# EAGLE design ArdulonShiled for Arduino_DUE (EAGLE 6.2)
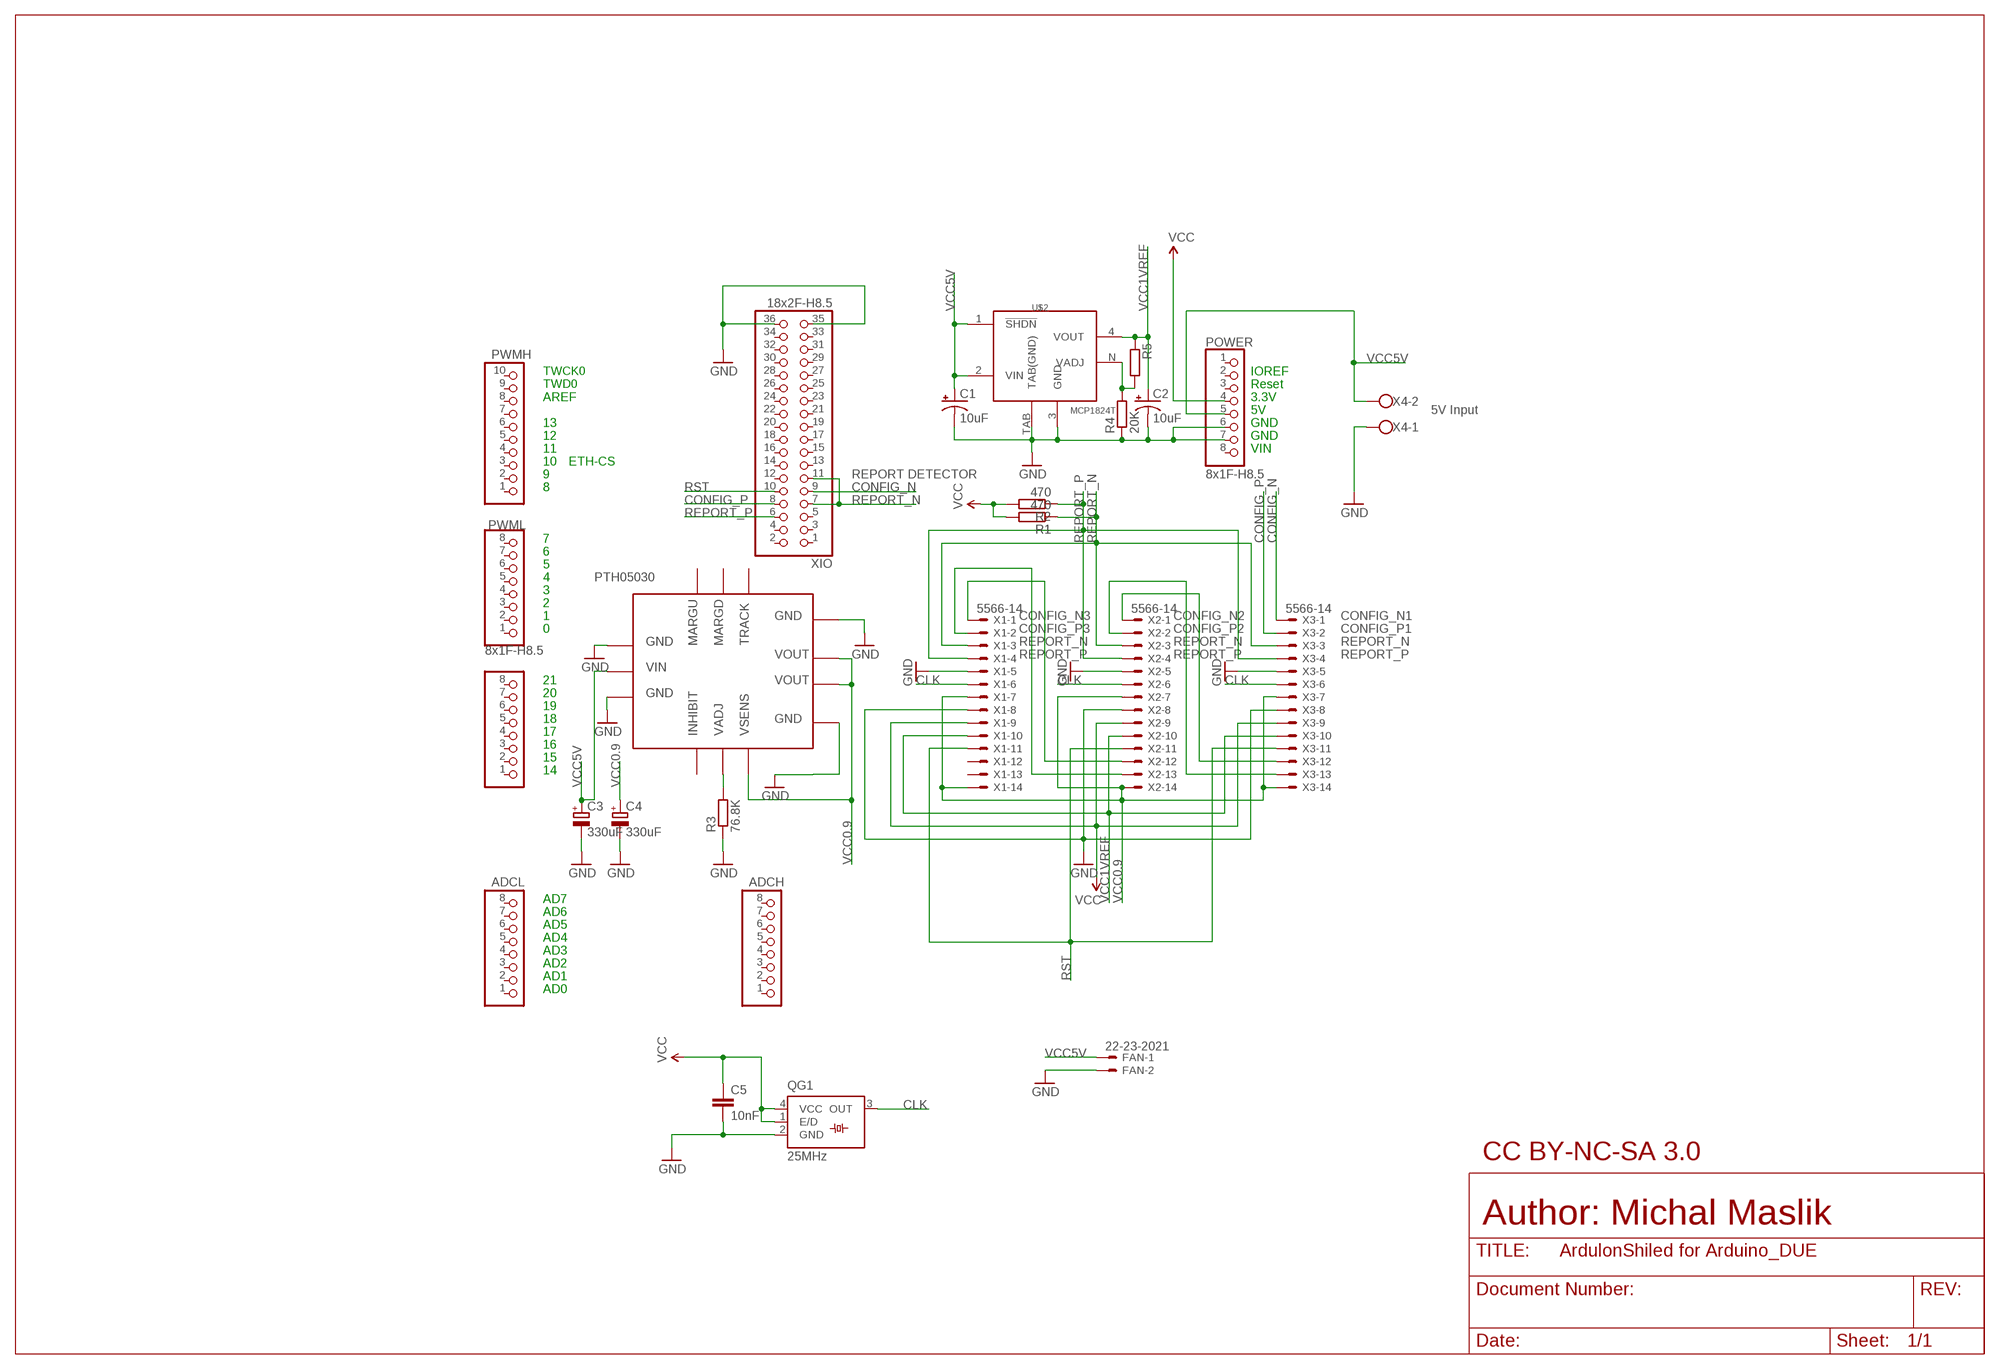
[diagram p0: schematic, sheet 1]

## Parts
ADCH  8x1F-H8.5  PINHD-1X8  [1X08]
ADCL  8x1F-H8.5  PINHD-1X8  [1X08]
C1  10uF  CAP_POL3528-KIT  [EIA3528-KIT]
C2  10uF  CAP_POL3528-KIT  [EIA3528-KIT]
C3  330uF  CPOL-EUSMCE  [SMC_E]
C4  330uF  CPOL-EUSMCE  [SMC_E]
C5  10nF  C-EUC0805  [C0805]
COMMUNICATION  8x1F-H8.5  PINHD-1X8  [1X08]
FAN  22-23-2021  [22-23-2021]
POWER  8x1F-H8.5  PINHD-1X8  [1X08]
PWMH  10x1F-H8.5  PINHD-1X10  [1X10]
PWML  8x1F-H8.5  PINHD-1X8  [1X08]
QG1  25MHz  SM77H  [SM77H]
R1  470  R-EU_M0805  [M0805]
R2  470  R-EU_M0805  [M0805]
R3  76.8K  R-EU_M0805  [M0805]
R4  20K  R-EU_M0805  [M0805]
R5  R-EU_M0805  [M0805]
U$1  PTH05030  [PTH05030]
U$2  MCP1824T  [SOT223-5]
X1  5566-14  [5566-14]
X2  5566-14  [5566-14]
X3  5566-14  [5566-14]
X4  W237-102  [W237-102]
XIO  18x2F-H8.5  PINHD-2X18  [2X18]

## Nets
CLK: QG1.3(OUT) X1.6 X2.6 X3.6
CONFIG_N: X3.1 XIO.9
CONFIG_P: X3.2 XIO.8
GND: C1.C(-) C2.C(-) C3.- C4.- C5.2 FAN.2 POWER.6 POWER.7 QG1.2(GND) R3.1 R4.1 U$1.1 U$1.3 U$1.7 U$1.10 U$2.3(GND) U$2.TAB(TAB(GND)) X1.5 X1.8 X2.5 X2.8 X3.5 X3.8 X4.1 XIO.35 XIO.36
N$1: R4.2 R5.2 U$2.N(VADJ)
N$2: X2.1 X3.12
N$3: R3.2 U$1.5
N$4: X2.2 X3.13
N$5: X1.1 X2.12
N$6: X1.2 X2.13
REPORT_N: R1.1 X1.3 X2.3 X3.3 XIO.7 XIO.11
REPORT_P: R2.1 X1.4 X2.4 X3.4 XIO.6
RST: X1.11 X2.11 X3.11 XIO.10
VCC: C5.1 POWER.4 QG1.1(E/D) QG1.4(VCC) R1.2 R2.2 X1.9 X2.9 X3.9
VCC0.9: C4.+ U$1.6 U$1.8 U$1.9 X1.7 X1.14 X2.7 X2.14 X3.7 X3.14
VCC1REF: C2.A(+) R5.1 U$2.4(VOUT) X1.10 X2.10 X3.10
VCC5V: C1.A(+) C3.+ FAN.1 POWER.5 U$1.2 U$2.1(!SHDN) U$2.2(VIN) X4.2
Unconnected: ADCH.1 ADCH.2 ADCH.3 ADCH.4 ADCH.5 ADCH.6 ADCH.7 ADCH.8 ADCL.1 ADCL.2 ADCL.3 ADCL.4 ADCL.5 ADCL.6 ADCL.7 ADCL.8 COMMUNICATION.1 COMMUNICATION.2 COMMUNICATION.3 COMMUNICATION.4 COMMUNICATION.5 COMMUNICATION.6 COMMUNICATION.7 COMMUNICATION.8 POWER.1 POWER.2 POWER.3 POWER.8 PWMH.1 PWMH.2 PWMH.3 PWMH.4 PWMH.5 PWMH.6 PWMH.7 PWMH.8 PWMH.9 PWMH.10 PWML.1 PWML.2 PWML.3 PWML.4 PWML.5 PWML.6 PWML.7 PWML.8 U$1.4 U$1.11 U$1.12 U$1.13 X1.12 X1.13 XIO.1 XIO.2 XIO.3 XIO.4 XIO.5 XIO.12 XIO.13 XIO.14 XIO.15 XIO.16 XIO.17 XIO.18 XIO.19 XIO.20 XIO.21 XIO.22 XIO.23 XIO.24 XIO.25 XIO.26 XIO.27 XIO.28 XIO.29 XIO.30 XIO.31 XIO.32 XIO.33 XIO.34

## Notes on the sheet
- VCC5V | VCC1VREF
- VCC5V
- TWCK0 | IOREF
- TWD0 | Reset
- AREF | 3.3V
- 5V | 5V Input
- 13 | GND
- 12 | GND
- 11 | VIN
- 10 | ETH-CS
- 9 | REPORT DETECTOR
- 8 | RST | CONFIG_N
- CONFIG_P | REPORT_N
- REPORT_P
- 7 | REPORT_P | REPORT_N | CONFIG_P | CONFIG_N
- 6
- 5
- 4
- 3
- 2
- 1 | CONFIG_N3 | CONFIG_N2 | CONFIG_N1
- 0 | CONFIG_P3 | CONFIG_P2 | CONFIG_P1
- REPORT_N | REPORT_N | REPORT_N
- REPORT_P | REPORT_P | REPORT_P
- 21 | CLK | CLK | CLK
- 20
- 19
- 18
- 17
- 16
- 15
- 14
- VCC5V | VCC0.9
- VCC0.9
- AD7 | VCC1VREF | VCC0.9
- AD6
- AD5
- AD4
- AD3
- AD2
- AD1 | RST
- AD0
- VCC5V
- CLK
- CC BY-NC-SA 3.0
- Author: Michal Maslik

## Library data of the parts
ADCH ADCL COMMUNICATION POWER PWML = SmartPrj:PINHD-1X8: PIN HEADER
C1 C2 = SparkFun:CAP_POL: Capacitor Polarized These are standard SMD and PTH capacitors. Normally 10uF, 47uF, and 100uF in electrolytic and tantalum varieties. Always verify the external diameter of the through hole cap, it varies with capacity, voltage, and manufacturer. The EIA devices should be standard.
C3 C4 = resistor:CPOL-EU: POLARIZED CAPACITOR, European symbol
C5 = rcl:C-EU: CAPACITOR, European symbol
FAN = con-molex:22-23-2021: .100" (2.54mm) Center Header - 2 Pin
PWMH = SmartPrj:PINHD-1X10: PIN HEADER
QG1 = crystal:SM77H: 3.3V CMOS Clock Oscillator Source: www.pletronics.com .. sm77h%203.3v.pdf; OC_FARNELL: unknown; OC_NEWARK: unknown
R1-R5 = rcl:R-EU_: RESISTOR, European symbol
U$1 = PTH5030WAS:PTH05030: PTH05030W DC/DC Converter - Adjustable, 108W
U$2 = BaseApp:MCP1824T
X1-X3 = con-molex:5566-14: Mini FIT connector 14 pol Source: http://www.molex.com
X4 = con-wago-500:W237-102: WAGO SCREW CLAMP; MPN: 237-102; OC_FARNELL: unknown; OC_NEWARK: 70K9898
XIO = SmartPrj:PINHD-2X18: PIN HEADER

## Net classes
0 default: width 0.203 mm, drill 0.305 mm, clearance 0.203 mm
1 USB: drill 0.406 mm, clearance 0.203 mm to class 0, clearance 0.406 mm
2 gnd: width 0.305 mm, drill 0.406 mm, clearance 0.203 mm to class 0, clearance 0.203 mm
3 usbvcc: width 0.61 mm, drill 0.508 mm, clearance 0.203 mm to class 0, clearance 0.254 mm

## Board
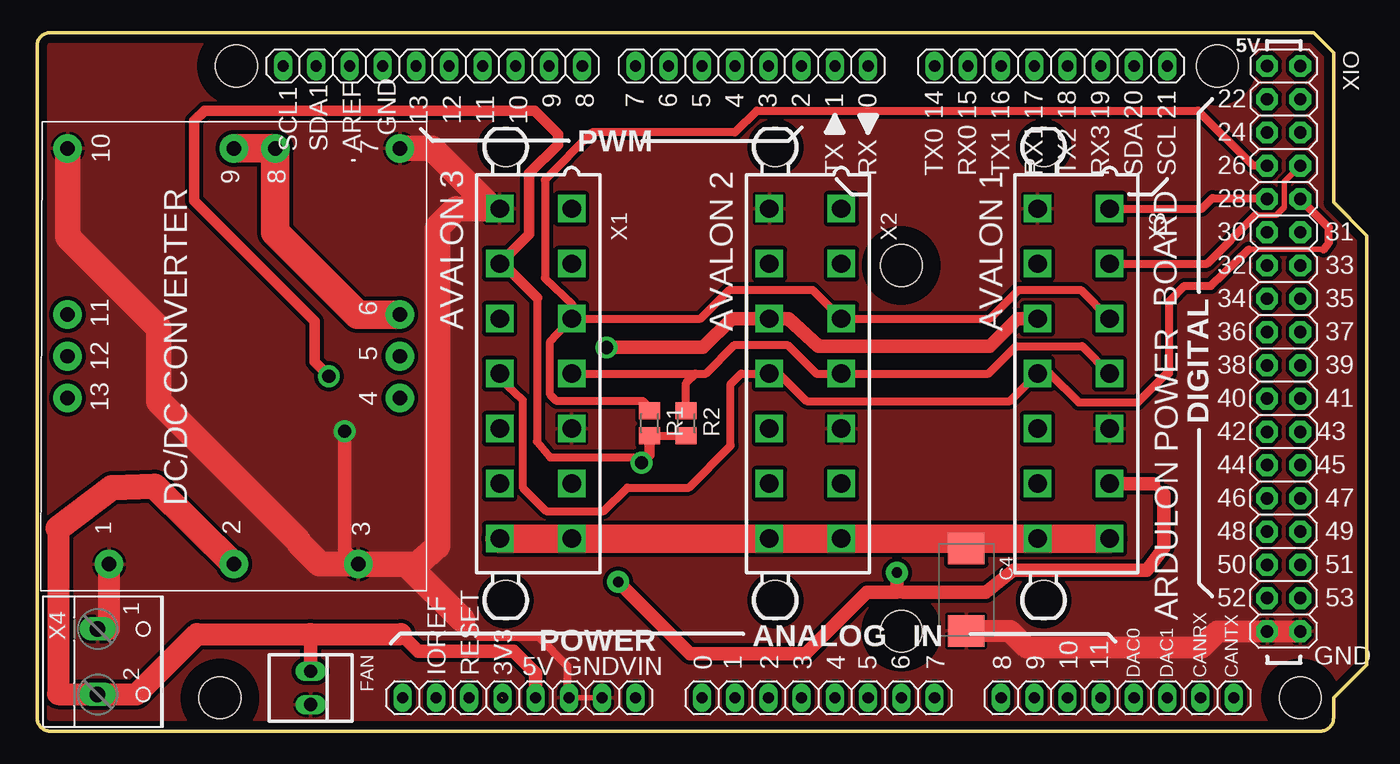
[diagram p1: board, top side]
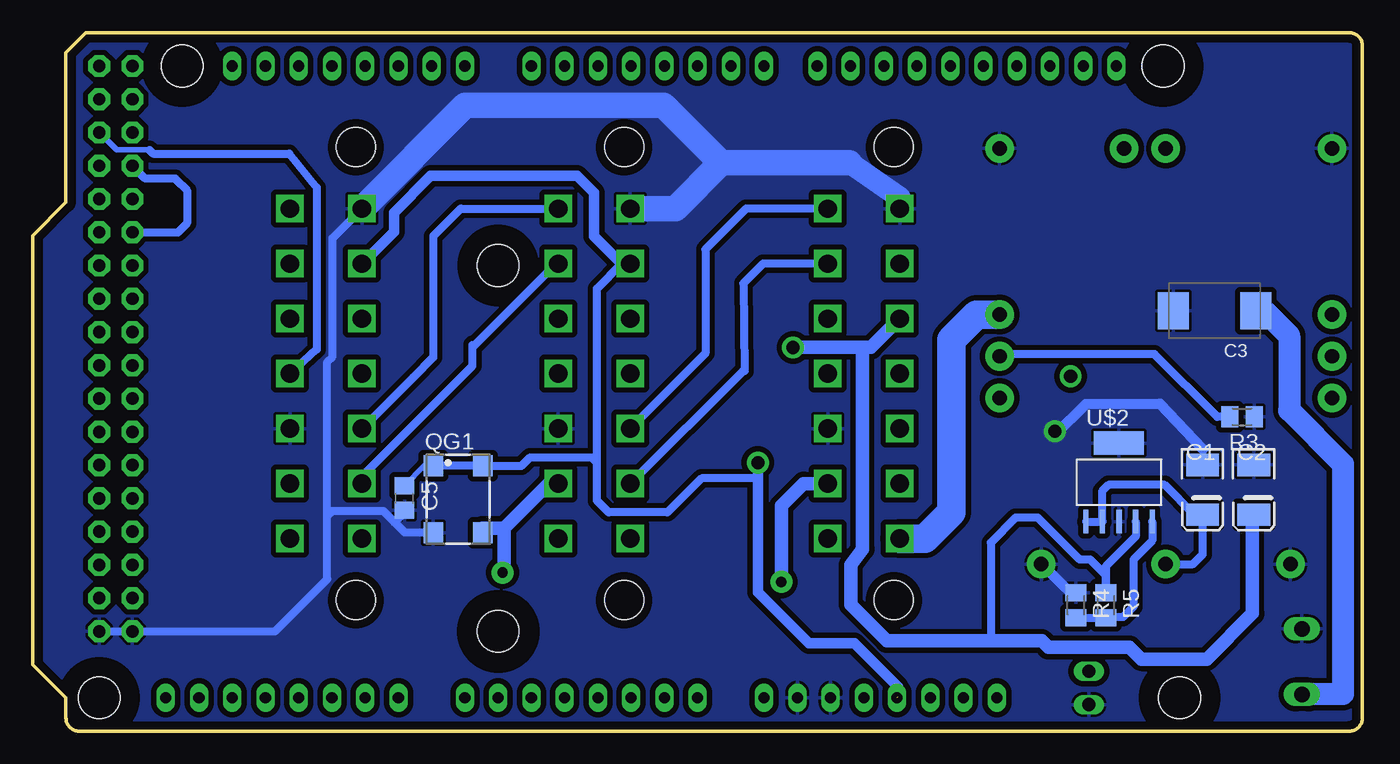
[diagram p2: board, bottom side, seen from below]

Size 101.6 x 53.34 mm. Coordinates in mm from the lower left corner, seen from the top.
Outline: 97.54,53.34 99.06,51.82 99.06,40.39 101.6,37.85 101.6,5.08 99.06,2.54 99.06,1 arc-90 98.06,0 1,0 arc-90 0,1 0,52.34 arc-90 1,53.34 97.54,53.34
Copper layers (1*2*15*16): Top 0.035mm / dielectric 0.2mm / Route2 0.035mm / dielectric 1mm / Route15 0.035mm / dielectric 0.2mm / Bottom 0.035mm
Design rules: minimum track width 8mil, minimum drill 16mil, track to track 8mil, track to pad 8mil, pad to pad 6mil, via to via 8mil, smd to smd 6mil, copper to edge 25mil, drill to drill 12mil, minimum pad ring 8mil, minimum via ring 8mil, stop-mask expansion 2mil, vias tented up to drill 25mil, thermal gap 8mil
Holes 3.2 mm at 96.52,2.54 15.24,50.8 90.17,50.8 13.97,2.54 66.04,35.56 66.04,7.62
tRestrict: area 63.5,5.1 to 68.6,10.2; area 12.7,48.3 to 17.8,53.3; area 63.5,33 to 68.6,38.1; area 87.6,48.3 to 92.7,53.3; area 94,0 to 99.1,5.1; area 11.4,0 to 16.5,5.1
bRestrict: area 63.5,5.1 to 68.6,10.2; area 12.7,48.3 to 17.8,53.3; area 63.5,33 to 68.6,38.1; area 87.6,48.3 to 92.7,53.3; area 94,0 to 99.1,5.1; area 11.4,0 to 16.5,5.1

### Footprints (pad centres in the part's own frame; a part is rotated, then mirrored left to right if it is on the bottom)
1X08 = drill 0.85 pad 1.422 long: 1 -8.89,0; 2 -6.35,0; 3 -3.81,0; 4 -1.27,0; 5 1.27,0; 6 3.81,0; 7 6.35,0; 8 8.89,0
EIA3528-KIT = smd 1.7 x 2.5: A 1.9,0; C -1.9,0
SMC_E = smd 2.4 x 2.8: + -3.15,0; - 3.15,0
C0805 = smd 1.3 x 1.5: 1 -0.95,0; 2 0.95,0
22-23-2021 = drill 1 long: 1 -1.27,0; 2 1.27,0
1X10 = drill 0.85 pad 1.422 long: 1 -11.43,0; 2 -8.89,0; 3 -6.35,0; 4 -3.81,0; 5 -1.27,0; 6 1.27,0; 7 3.81,0; 8 6.35,0; 9 8.89,0; 10 11.43,0
SM77H = smd 1.6 x 1.5: 1 -2.55,-1.9; 2 2.55,-1.9; 3 2.55,1.9; 4 -2.55,1.9
M0805 = smd 1.3 x 1.6: 1 -0.95,0; 2 0.95,0
PTH05030 = drill 1.1 pad 2.184: 1 -15.75,7.49; 2 -15.75,-2.03; 3 -15.75,-11.55; 4 -3.05,-14.72; 5 0.13,-14.72; 6 3.31,-14.72; 7 16,-14.73; 8 16,-5.21; 9 16,-2.03; 10 16,10.67; 11 3.31,10.67; 12 0.13,10.67; 13 -3.05,10.67
SOT223-5 = smd 0.4 x 1.8: 1 -2.54,-3; 2 -1.27,-3; 3 0,-3; 4 1.27,-3; N 2.54,-3 | smd 3.81 x 1.8: TAB 0,3
5566-14 = drill 1.4 square: 1 12.6,-2.75; 2 8.4,-2.75; 3 4.2,-2.75; 4 0,-2.75; 5 -4.2,-2.75; 6 -8.4,-2.75; 7 -12.6,-2.75; 8 12.6,2.75; 9 8.4,2.75; 10 4.2,2.75; 11 0,2.75; 12 -4.2,2.75; 13 -8.4,2.75; 14 -12.6,2.75 | hole 3: 17.3,2.29; -17.3,2.29
W237-102 = drill 1.194 long: 1 -2.5,-1.27; 2 2.5,-1.27
2X18 = drill 0.95 pad 1.676 octagon: 1 -21.59,-1.27; 2 -21.59,1.27; 3 -19.05,-1.27; 4 -19.05,1.27; 5 -16.51,-1.27; 6 -16.51,1.27; 7 -13.97,-1.27; 8 -13.97,1.27; 9 -11.43,-1.27; 10 -11.43,1.27; 11 -8.89,-1.27; 12 -8.89,1.27; 13 -6.35,-1.27; 14 -6.35,1.27; 15 -3.81,-1.27; 16 -3.81,1.27; 17 -1.27,-1.27; 18 -1.27,1.27; 19 1.27,-1.27; 20 1.27,1.27; 21 3.81,-1.27; 22 3.81,1.27; 23 6.35,-1.27; 24 6.35,1.27; 25 8.89,-1.27; 26 8.89,1.27; 27 11.43,-1.27; 28 11.43,1.27; 29 13.97,-1.27; 30 13.97,1.27; 31 16.51,-1.27; 32 16.51,1.27; 33 19.05,-1.27; 34 19.05,1.27; 35 21.59,-1.27; 36 21.59,1.27

### Placement (x,y rotation side)
ADCH  82.55,2.54 0 top
ADCL  59.69,2.54 0 top
C1  12.21,18.43 270 bottom
C2  8.3,18.43 270 bottom
C3  11.3,32.1 180 bottom
C4  71,10.8 270 top
C5  73.2,17.8 270 bottom
COMMUNICATION  77.47,50.8 0 top
FAN  20.9,3.3 270 top
POWER  36.83,2.54 0 top
PWMH  30.23,50.8 180 top
PWML  54.61,50.8 180 top
QG1  69.1,17.7 270 bottom
R1  46.8,23.5 270 top
R2  49.6,23.5 270 top
R3  9.2,24 180 bottom
R4  21.9,9.6 270 bottom
R5  19.6,9.6 270 bottom
U$1  13,28.5 90 top
U$2  18.6,19 0 bottom
X1  38.1,27.3 90 top
X2  58.7,27.3 90 top
X3  79.2,27.3 90 top
X4  5.9,5.3 270 top
XIO  95.25,29.21 270 top

### Tracks (layer width: path | path; a pad name or v marks a point on that pad's centre or on a via)
CLK  (via drill 0.8 pad 1.68)
  Top 0.61: 65.7,10.6 66.2,10.6 | 86.1,18.1 85.3,18.9
  Top 1.016: 66.2,10.6 72.5,10.6 74.6,12.3 84.8,12.3 86.1,14 86.1,18.1 | v44.4,11.4 49.9,5.9 58.7,5.9 63.4,10.6 65.7,10.6 v65.7,12.1 | 85.3,18.9 X3.6
  Bottom 0.61: 65.6,12.5 v65.7,12.1 | 67.25,15.5 QG1.3
  Bottom 1.016: v44.4,11.4 44.4,17.2 42.7,18.9 X1.6 | X2.6 62.2,18.9 65.6,15.5 | 65.6,15.5 65.6,12.5 | 65.6,15.5 67.25,15.5
CONFIG_N
  Top 0.61: X3.1 89,39.9 89.8,40.7 93.92,40.7 XIO.9
CONFIG_P
  Top 0.406: 93.1,39.4 94.7,39.4 95.3,40 95.3,41.96 XIO.8
  Top 0.61: X3.2 89.4,35.7 93.1,39.4
GND  (via drill 1 pad 1.68)
  Top 0.406: POWER.7 POWER.6
  Top 0.61: 32,39.9 32.6,39.9 | 32.5,8.5 33.8,7.2 38.3,7.2 40.5,5 40.5,2.68
  Top 1.016: v23.5,22.9 23.5,13.8 U$1.3
  Top 1.676: 34.8,39.9 X1.8 | C4.- 74.35,7.65 75.6,6.4 88.98,6.4 90.2,7.62 XIO.36 | X4.1 5.51,7.8 U$1.1
  Top 1.93: 32,39.9 30.6,38.5 30.6,14.1 29.05,12.75 28.25,12.75 | 32.6,39.9 34.8,39.9 30.2,44.5 U$1.7 | 28.25,12.75 32.5,8.5 | 28.25,12.75 U$1.3 21.6,12.8 20,14.4 20,14.5 9.3,25.2 9.3,30.8 2.33,37.77 U$1.10
  Bottom 0.61: X1.8 35.35,40.75 | XIO.36 XIO.35 83.08,7.62 79.1,11.6 79.1,16.4 | 79.1,16.4 79.1,28.2 78.7,28.6 78.7,37.65 X3.8 | 23.5,22.63 v23.5,22.9 | 8.3,24.25 R3.1 | QG1.2 73.15,15.15 73.95,15.95 | 73.95,15.95 74.8,16.8 78.7,16.8 79.1,16.4 | C5.2 73.2,16.7 73.95,15.95
  Bottom 0.813: 12.21,21.51 15.5,25 21.13,24.97 23.5,22.63 | R4.1 22.05,10.35 U$1.3
  Bottom 1.27: 34.91,39.46 X1.8
  Bottom 1.676: 35.35,40.75 39.2,43.4
  Bottom 1.93: 39.2,43.4 49,43.4 | 49,43.4 53.4,47.8 68.55,47.8 X3.8 | X2.8 52.5,39.9 49,43.4
  pour Top (isolate 0.305, rank 2): 101.83,53.42 101.63,0.03 -0.05,0.03 -0.05,51.7 arc-90 1.64,53.31
  pour Bottom (isolate 0.406, rank 2): 1.64,53.42 101.76,53.42 101.76,0 -0.3,-0.03 -0.41,51.27 arc-90
N$1
  Bottom 0.61: R4.2 R5.2 19.55,8.7 18.3,8.7 17.5,9.5 17.5,13.1 16.06,14.54 U$2.N
N$2
  Bottom 0.61: X2.1 68.9,39.9 71,37.8 71,28.55 72.55,27 X3.12
N$3
  Bottom 0.61: R3.2 11.1,24 15.9,28.8 27.55,28.8 U$1.5
N$4
  Bottom 0.61: X3.13 76.45,19.45 73.5,22.4 68,27.9 68,29.3 | 68,29.3 68,29.5 | X2.2 61.6,35.7 68,29.3
N$5
  Bottom 0.61: X1.1 47.1,39.9 50.2,36.8 50.2,28.85 X2.12
N$6
  Bottom 0.61: X1.2 45.8,35.7 47.3,34.2 47.2,27.5 47.35,27.5 X2.13
REPORT_N
  Top 0.61: X1.3 50.7,31.5 52.9,33.7 59.25,33.7 X2.3 72.8,31.5 75,33.7 79.75,33.7 X3.3 | R1.1 46.75,24.45 46.73,24.78 46.28,25.2 39.7,25.2 39.2,25.7 39.2,29.75 X1.3 | 40.75,31.6 X1.3 | XIO.7 93.96,43.2 92.9,43.2 88.7,47.4 55,47.4 53.32,45.72 42.42,45.72 38.8,42.1 38.8,34.6 40.9,32.6 40.9,31.55 X1.3
  Bottom 0.61: XIO.11 90.5,38.1 89.8,38.8 89.8,41.3 90.7,42.2 93,42.2 XIO.7
REPORT_P
  Top 0.61: X1.4 50.3,27.3 | 50.3,27.3 51.1,27.3 53.3,29.5 57.34,29.5 59.53,27.3 X2.4 72.7,27.3 74.8,29.4 79.85,29.4 X3.4 | R2.1 49.6,26.6 50.3,27.3
  Bottom 0.406: 92.7,44.4 95.2,44.4 XIO.6
  Bottom 0.61: X3.4 79.9,29.15 79.9,41.5 82,44.1 92.4,44.1 92.7,44.4
RST
  Top 0.406: 92.6,36.8 98.3,36.8
  Top 0.61: 92.6,36.8 89.7,34 87.67,34 86.5,32.83 86.5,27.3 86.3,27.3 84.1,25.1 79.6,25.1 77.4,27.3 X3.11 74.35,25.2 58.8,25.2 56.7,27.3 X2.11 53.8,27.3 53,26.5 53,21.8 49.8,18.6 45.1,18.6 43.3,16.8 38.9,16.8 37.1,18.6 37.1,25.3 35.35,26.95 X1.11 | 98.3,36.8 98.7,37.3 98.7,38.46 XIO.10
VCC  (via drill 1 pad 1.68)  (1 unrouted)
  Top 0.61: R2.2 R1.2 46.75,22.6 | X1.9 35.6,35.7 | 38.2,33.1 38.2,22.1 39.2,20.9 45.8,20.9 v46.2,20.5
  Top 0.813: R1.2 46.8,21.1 v46.2,20.5 | X1.9 37.6,37.95 37.6,42.6 39.8,44.8 39.8,45.6 38,47.4 12.8,47.4 12,46.6 12,40.5 21.2,31.3 21.2,28.2 v22.3,27.1 | 35.6,35.7 38.2,33.1
  Bottom 0.406: C5.1 71.7,20.25 QG1.1
  Bottom 0.61: 46.2,19.3 50.5,19.3 53.1,16.7 57.6,16.7 58.5,17.6 58.5,20.5 | 58.5,20.5 58.5,33.8 56.6,35.7 | QG1.1 QG1.4 64.25,20.25 63.6,20.9 58.9,20.9 58.5,20.5
  Bottom 0.813: v46.2,20.5 46.2,19.3 46.2,10.6 42.3,6.7 38.8,6.7 35.5,3.4 35.5,2.6 | X2.9 56.6,35.7 58.7,37.8 58.7,41.1 60,42.4 71.2,42.4 74,39.6 74,38.15 X3.9
VCC0.9
  Top 1.93: U$1.6 | C4.+ 71.1,13.95 71.1,14.7
  Top 2.184: U$1.9 U$1.8 18.21,38.09 24.5,31.8 U$1.6 | X1.14 X1.7 X2.14 X2.7 71.1,14.7 X3.14 X3.7
  Bottom 2.184: U$1.6 29.49,31.81 31.4,29.9 31.4,16.72 33.42,14.7 X1.14
VCC1REF  (via drill 1 pad 1.68)
  Top 1.016: X3.10 74.9,31.5 72.8,29.4 59.7,29.4 57.4,31.5 X2.10 53.1,31.5 50.9,29.3 v43.5,29.3
  Bottom 0.61: 37.55,29.3 37.8,29.3 38.2,29 | 35.45,31.4 X1.10 | U$2.4 17.33,14.87 19.6,12.6 R5.1 19.6,11.9 20.8,13.1 21.6,13.1 24.8,16.3 26.5,16.3 28.4,14.4 28.4,6.9 | 17.5,6.1 17.4,6
  Bottom 1.016: v43.5,29.3 37.8,29.3 | 37.55,29.3 35.45,31.4 | 38.2,29 38.2,13.9 39.1,12.7 39.1,9.67 36.33,6.9 28.4,6.9 24.5,6.9 24,6.4 17.8,6.4 17.4,6 16.9,5.5 11.9,5.5 8.4,9 8.4,16.43 C2.A
VCC5V
  Top 0.61: POWER.5 38.1,3.1
  Top 1.016: FAN.1 20.9,7.4 | 27.8,7.4 29.1,6.1 36.4,6.1 38.1,4.4 POWER.5
  Top 1.676: 1.6,15.5 1.6,2.83 X4.2 7.6,2.8 12.2,7.4 20.9,7.4 27.8,7.4
  Top 1.93: 1.6,15.5 5.7,18.6 8.98,18.7 U$1.2
  Bottom 0.406: U$2.1 21.1,16
  Bottom 0.61: 21.1,16 U$2.2 19.9,16.03 19.9,18.3 19.4,18.8 15.1,18.8 12.83,16.53 | U$1.2 12.95,12.75 12.2,13.5 C1.A
  Bottom 1.016: C1.A 12.83,16.53
  Bottom 1.676: C3.+ 7.5,32.1 5.6,30.2 5.6,24.5 1.5,20.4 1.5,2.83 2,2.83 4.6,2.83 X4.2

### Text on the board
tPlace: 9 | 8 | 7 | 6 | 5 | 4 | 3 | 2 | 1 | 0 | 22 | 14 | 15 | 16 | 17 | 18 | 19 | 20 | 21 | 13 | 12 | 11 | 10 | 24 | 26 | 28 | 30 | 31 | 32 | 33 | 34 | 35 | 36 | 37 | 38 | 39 | 40 | 41 | 42 | 43 | 44 | 45 | 46 | 47 | 48 | 49 | 50 | 51 | 52 | 53 | 0 | 1 | 2 | 3 | 4 | 5 | 6 | 7 | 8 | 9 | 10 | 11 | DAC0 | DAC1 | CANRX | CANTX
tNames: 5V | GND | SCL1 | SDA1 | AREF | PWM | AVALON 3 | AVALON 2 | AVALON 1 | TX | RX | TX0 | RX0 | TX1 | RX1 | TX2 | RX3 | SDA | SCL | BOARD | ARDULON POWER | DIGITAL | ANALOG IN | GND | IOREF | RESET | 3V3 | 5V | GND | VIN